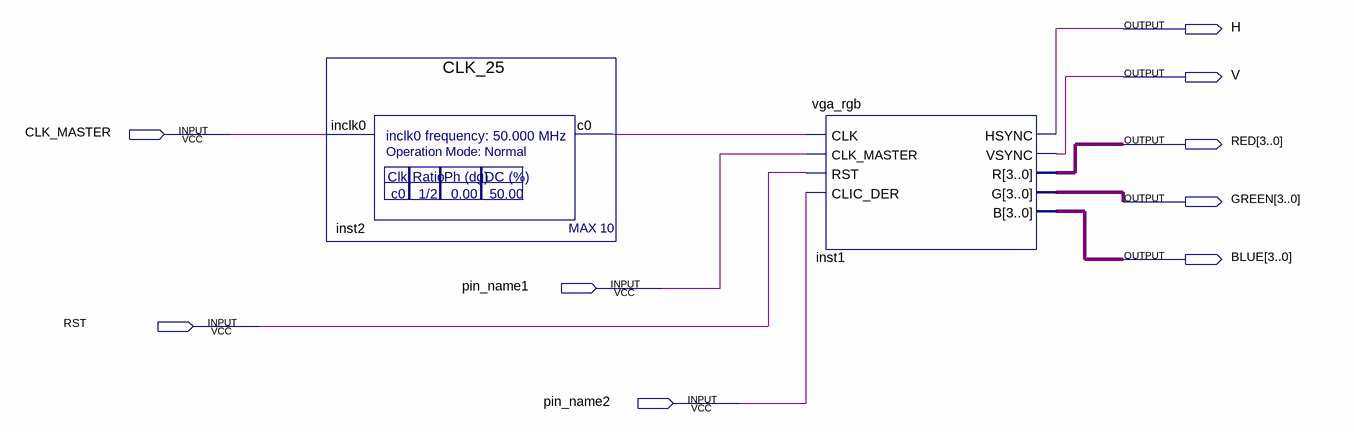
[diagram p0: schematic sheet]
// Quartus schematic Block3.bdf as structural Verilog: 2 symbols, 9 pins
module Block3 (
  input  CLK_MASTER,
  input  pin_name1,
  input  RST,
  input  pin_name2,
  output H,
  output V,
  output [3:0] RED,
  output [3:0] GREEN,
  output [3:0] BLUE
);

  wire inst2_c0;

  CLK_25 inst2 (.inclk0(CLK_MASTER), .c0(inst2_c0));
  vga_rgb inst1 (
    .CLK(inst2_c0), .CLK_MASTER(pin_name1), .RST(RST), .CLIC_DER(pin_name2), .HSYNC(H), .VSYNC(V), .R(RED),
    .G(GREEN), .B(BLUE));
endmodule
